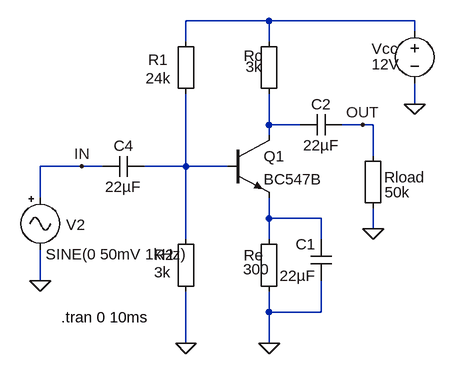
[diagram p0: schematic amp.asc]
amp.asc, the LTspice schematic file:
Version 4
SHEET 1 880 680
WIRE 192 -64 64 -64
WIRE 416 -64 192 -64
WIRE 416 -48 416 -64
WIRE 64 -32 64 -64
WIRE 192 -32 192 -64
WIRE 416 64 416 32
WIRE 192 96 192 48
WIRE 240 96 192 96
WIRE 336 96 304 96
WIRE 352 96 336 96
WIRE 192 112 192 96
WIRE 352 144 352 96
WIRE -96 160 -160 160
WIRE -64 160 -96 160
WIRE 64 160 64 48
WIRE 64 160 0 160
WIRE 128 160 64 160
WIRE -160 208 -160 160
WIRE 192 240 192 208
WIRE 272 240 192 240
WIRE 352 256 352 224
WIRE 64 272 64 160
WIRE 192 272 192 240
WIRE 272 272 272 240
WIRE -160 336 -160 288
WIRE 192 384 192 352
WIRE 272 384 272 336
WIRE 272 384 192 384
WIRE 64 432 64 352
WIRE 192 432 192 384
FLAG 64 432 0
FLAG 192 432 0
FLAG -160 336 0
FLAG 416 64 0
FLAG -96 160 IN
FLAG 336 96 OUT
FLAG 352 256 0
SYMBOL npn 128 112 R0
SYMATTR InstName Q1
SYMATTR Value BC547B
SYMBOL Misc\\EuropeanResistor 48 256 R0
WINDOW 0 -33 40 Left 2
WINDOW 3 -33 67 Left 2
SYMATTR InstName R2
SYMATTR Value 3k
SYMBOL Misc\\EuropeanResistor 48 -48 R0
WINDOW 0 -42 44 Left 2
WINDOW 3 -46 72 Left 2
SYMATTR InstName R1
SYMATTR Value 24k
SYMBOL Misc\\EuropeanResistor 176 -48 R0
WINDOW 0 -23 38 Left 2
WINDOW 3 -20 55 Left 2
SYMATTR InstName Rc
SYMATTR Value 3k
SYMBOL Misc\\EuropeanResistor 176 256 R0
WINDOW 0 -23 41 Left 2
WINDOW 3 -24 62 Left 2
SYMATTR InstName Re
SYMATTR Value 300
SYMBOL Misc\\signal -160 192 R0
WINDOW 123 0 0 Left 2
WINDOW 0 40 58 Left 2
WINDOW 3 8 103 Left 2
SYMATTR InstName V2
SYMATTR Value SINE(0 50mV 1kHz)
SYMATTR SpiceLine Rser=2k
SYMBOL voltage 416 -64 R0
WINDOW 0 -66 43 Left 2
WINDOW 3 -66 67 Left 2
WINDOW 123 0 0 Left 2
WINDOW 39 0 0 Left 2
SYMATTR InstName Vcc
SYMATTR Value 12V
SYMBOL cap 0 144 R90
WINDOW 0 0 32 VBottom 2
WINDOW 3 32 32 VTop 2
SYMATTR InstName C4
SYMATTR Value 22µF
SYMBOL cap 288 336 R180
WINDOW 0 24 56 Left 2
WINDOW 3 24 8 Left 2
SYMATTR InstName C1
SYMATTR Value 22µF
SYMBOL cap 304 80 R90
WINDOW 0 0 32 VBottom 2
WINDOW 3 32 32 VTop 2
SYMATTR InstName C2
SYMATTR Value 22µF
SYMBOL Misc\\EuropeanResistor 336 128 R0
WINDOW 0 33 49 Left 2
WINDOW 3 34 72 Left 2
SYMATTR InstName Rload
SYMATTR Value 50k
TEXT -128 392 Left 2 !.tran 0 10ms

The netlist it stands for:
* amp.asc
Q1 N002 N003 N004 0 BC547B
R2 N003 0 3k
R1 N001 N003 24k
Rc N001 N002 3k
Re N004 0 300
V2 IN 0 SINE(0 50mV 1kHz) Rser=2k
Vcc N001 0 12V
C4 N003 IN 22µF
C1 0 N004 22µF
C2 OUT N002 22µF
Rload OUT 0 50k
.model NPN NPN
.model PNP PNP
.lib standard.bjt
.tran 0 10ms
.backanno
.end